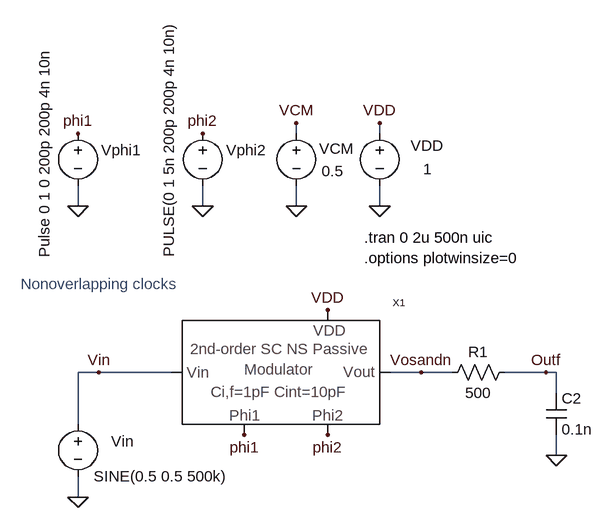
[diagram p0: schematic _Fig6_21_2nd_symbol_MSD.asc]
_Fig6_21_2nd_symbol_MSD.asc, the LTspice schematic file:
Version 4
SHEET 1 928 680
WIRE -112 -240 -112 -256
WIRE 16 -240 16 -256
WIRE -448 -128 -448 -160
WIRE -256 -128 -256 -160
WIRE -112 -128 -112 -160
WIRE 16 -128 16 -160
WIRE -416 128 -448 128
WIRE -304 128 -416 128
WIRE 80 128 32 128
WIRE 128 128 80 128
WIRE 272 128 208 128
WIRE 288 128 272 128
WIRE 288 160 288 128
WIRE -448 208 -448 128
WIRE 288 256 288 224
WIRE -448 320 -448 288
FLAG 16 -128 0
FLAG 16 -256 VDD
FLAG -112 -128 0
FLAG -112 -256 VCM
FLAG 80 128 Vosandn
FLAG -448 320 0
FLAG -416 128 Vin
FLAG 288 256 0
FLAG 272 128 Outf
FLAG -64 32 VDD
FLAG -448 -128 0
FLAG -448 -240 phi1
FLAG -256 -128 0
FLAG -256 -240 phi2
FLAG -192 224 phi1
FLAG -64 224 phi2
SYMBOL voltage 16 -256 R0
WINDOW 0 48 35 Left 0
WINDOW 3 67 71 Left 0
SYMATTR InstName VDD
SYMATTR Value 1
SYMBOL voltage -112 -256 R0
WINDOW 0 35 39 Left 0
WINDOW 3 39 74 Left 0
SYMATTR InstName VCM
SYMATTR Value 0.5
SYMBOL voltage -448 192 R0
WINDOW 0 51 42 Left 0
WINDOW 123 0 0 Left 0
WINDOW 39 0 0 Left 0
SYMATTR InstName Vin
SYMATTR Value SINE(0.5 0.5 500k)
SYMBOL res 224 112 R90
WINDOW 0 0 56 VBottom 0
WINDOW 3 32 56 VTop 0
SYMATTR InstName R1
SYMATTR Value 500
SYMBOL cap 272 160 R0
SYMATTR InstName C2
SYMATTR Value 0.1n
SYMBOL voltage -448 -256 R0
WINDOW 0 36 42 Left 0
WINDOW 3 -52 207 VLeft 0
WINDOW 123 0 0 Left 0
WINDOW 39 0 0 Left 0
SYMATTR InstName Vphi1
SYMATTR Value Pulse 0 1 0 200p 200p 4n 10n
SYMBOL voltage -256 -256 R0
WINDOW 0 36 42 Left 0
WINDOW 3 -52 207 VLeft 0
WINDOW 123 0 0 Left 0
WINDOW 39 0 0 Left 0
SYMATTR InstName Vphi2
SYMATTR Value PULSE(0 1 5n 200p 200p 4n 10n)
SYMBOL 1_bit_2nd_PNS_SCmod_MSD -288 208 R0
SYMATTR InstName X1
TEXT -8 -80 Left 0 !.tran 0 2u 500n uic
TEXT -8 -48 Left 0 !.options plotwinsize=0
TEXT -536 -8 Left 0 ;Nonoverlapping clocks

The netlist it stands for:
* _Fig6_21_2nd_symbol_MSD.asc
VDD VDD 0 1
VCM VCM 0 0.5
Vin Vin 0 SINE(0.5 0.5 500k)
R1 Outf Vosandn 500
C2 Outf 0 0.1n
Vphi1 phi1 0 Pulse 0 1 0 200p 200p 4n 10n
Vphi2 phi2 0 PULSE(0 1 5n 200p 200p 4n 10n)
XX1 Vin VDD Vosandn phi1 phi2 1_bit_2nd_PNS_SCmod_MSD  ; pins Vin VDD Vout phi1 phi2
.tran 0 2u 500n uic
.options plotwinsize=0
* Nonoverlapping clocks
.backanno
.end